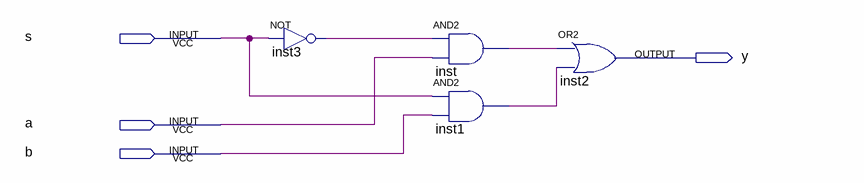
[diagram p0: schematic sheet]
// Quartus schematic t_mux.bdf as structural Verilog: 4 symbols, 4 pins
module t_mux (
  input  s,
  input  a,
  input  b,
  output y
);

  wire inst1_out, inst3_out, inst_out;

  not inst3 (inst3_out, s);
  and inst (inst_out, inst3_out, a);
  and inst1 (inst1_out, s, b);
  or inst2 (y, inst_out, inst1_out);
endmodule
